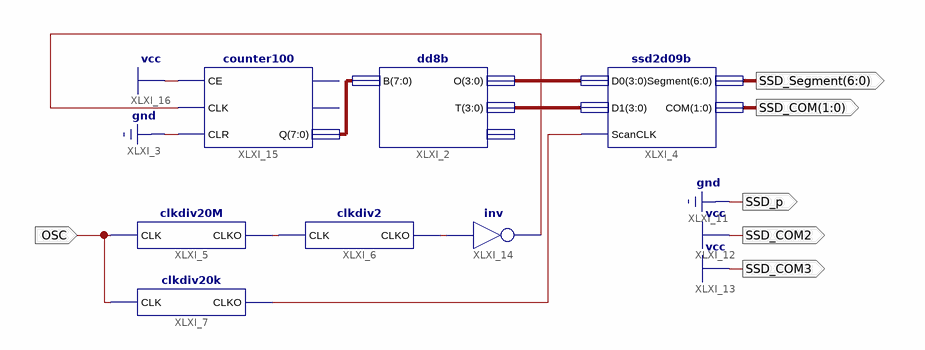
[diagram p0: schematic sheet 1]
// Xilinx ISE schematic main.sch (spartan6) as structural Verilog: 7 symbols, 6 ports
module main (
  input  OSC,
  output [1:0] SSD_COM,
  output [6:0] SSD_Segment,
  output SSD_p,
  output SSD_COM2,
  output SSD_COM3
);

  wire XLXN_7, XLXN_8, XLXN_9, XLXN_15;
  wire [3:0] XLXN_3, XLXN_4;
  wire [7:0] XLXN_18;

  dd8b XLXI_2 (.B(XLXN_18), .O(XLXN_3), .T(XLXN_4));  // open: H
  ssd2d09b XLXI_4 (.COM(SSD_COM), .D0(XLXN_3), .D1(XLXN_4), .ScanCLK(XLXN_9), .Segment(SSD_Segment));
  clkdiv20M XLXI_5 (.CLK(OSC), .CLKO(XLXN_7));
  clkdiv2 XLXI_6 (.CLK(XLXN_7), .CLKO(XLXN_15));
  clkdiv20k XLXI_7 (.CLK(OSC), .CLKO(XLXN_9));
  not XLXI_14 (XLXN_8, XLXN_15);
  counter100 XLXI_15 (.CE(1'b1), .CLK(XLXN_8), .CLR(1'b0), .Q(XLXN_18));  // open: CEO, TC

  assign SSD_COM2 = 1'b1;
  assign SSD_COM3 = 1'b1;
  assign SSD_p = 1'b0;
endmodule
